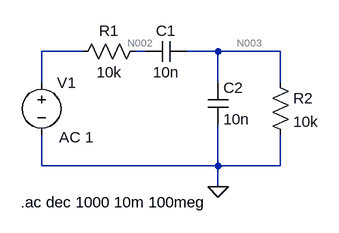
[diagram p0: schematic RC Phase Shift Oscillator.asc]
RC Phase Shift Oscillator.asc, the LTspice schematic file:
Version 4
SHEET 1 888 680
WIRE 256 176 192 176
WIRE 352 176 336 176
WIRE 464 176 416 176
WIRE 560 176 464 176
WIRE 192 224 192 176
WIRE 464 224 464 176
WIRE 560 224 560 176
WIRE 192 352 192 304
WIRE 464 352 464 288
WIRE 464 352 192 352
WIRE 560 352 560 304
WIRE 560 352 464 352
WIRE 464 384 464 352
FLAG 464 384 0
SYMBOL cap 352 192 R270
WINDOW 0 32 32 VTop 2
WINDOW 3 0 32 VBottom 2
SYMATTR InstName C1
SYMATTR Value 10n
SYMBOL res 240 192 R270
WINDOW 0 32 56 VTop 2
WINDOW 3 0 56 VBottom 2
SYMATTR InstName R1
SYMATTR Value 10k
SYMBOL cap 448 224 R0
SYMATTR InstName C2
SYMATTR Value 10n
SYMBOL res 544 208 R0
SYMATTR InstName R2
SYMATTR Value 10k
SYMBOL voltage 192 208 R0
WINDOW 123 27 100 Left 2
WINDOW 39 0 0 Left 0
SYMATTR Value2 AC 1
SYMATTR InstName V1
SYMATTR Value ""
TEXT 160 408 Left 2 !.ac dec 1000 10m 100meg

The netlist it stands for:
* RC Phase Shift Oscillator.asc
C1 N002 N003 10n
R1 N001 N002 10k
C2 N003 0 10n
R2 N003 0 10k
V1 N001 0 AC 1
.ac dec 1000 10m 100meg
.backanno
.end

* Results of the author's LTspice run, read from the files saved beside the schematic
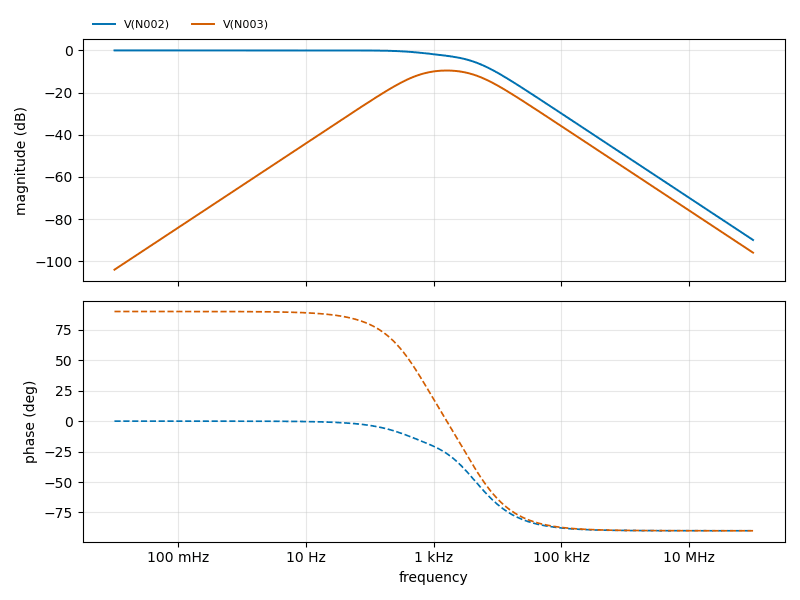
[diagram p1: AC Analysis of RC Phase Shift Oscillator.asc, plotted from the saved traces]
* AC Analysis, 1 run:
*   V(N002): -0.00 dB at 10 mHz, -89.94 dB at 100 MHz, peak -0.00 dB at 10 mHz, 3 dB below the peak at 2.024 kHz
*   V(N003): -104.04 dB at 10 mHz, -95.96 dB at 100 MHz, peak -9.54 dB at 1.592 kHz, 3 dB below the peak at 481.9 Hz and 5.257 kHz